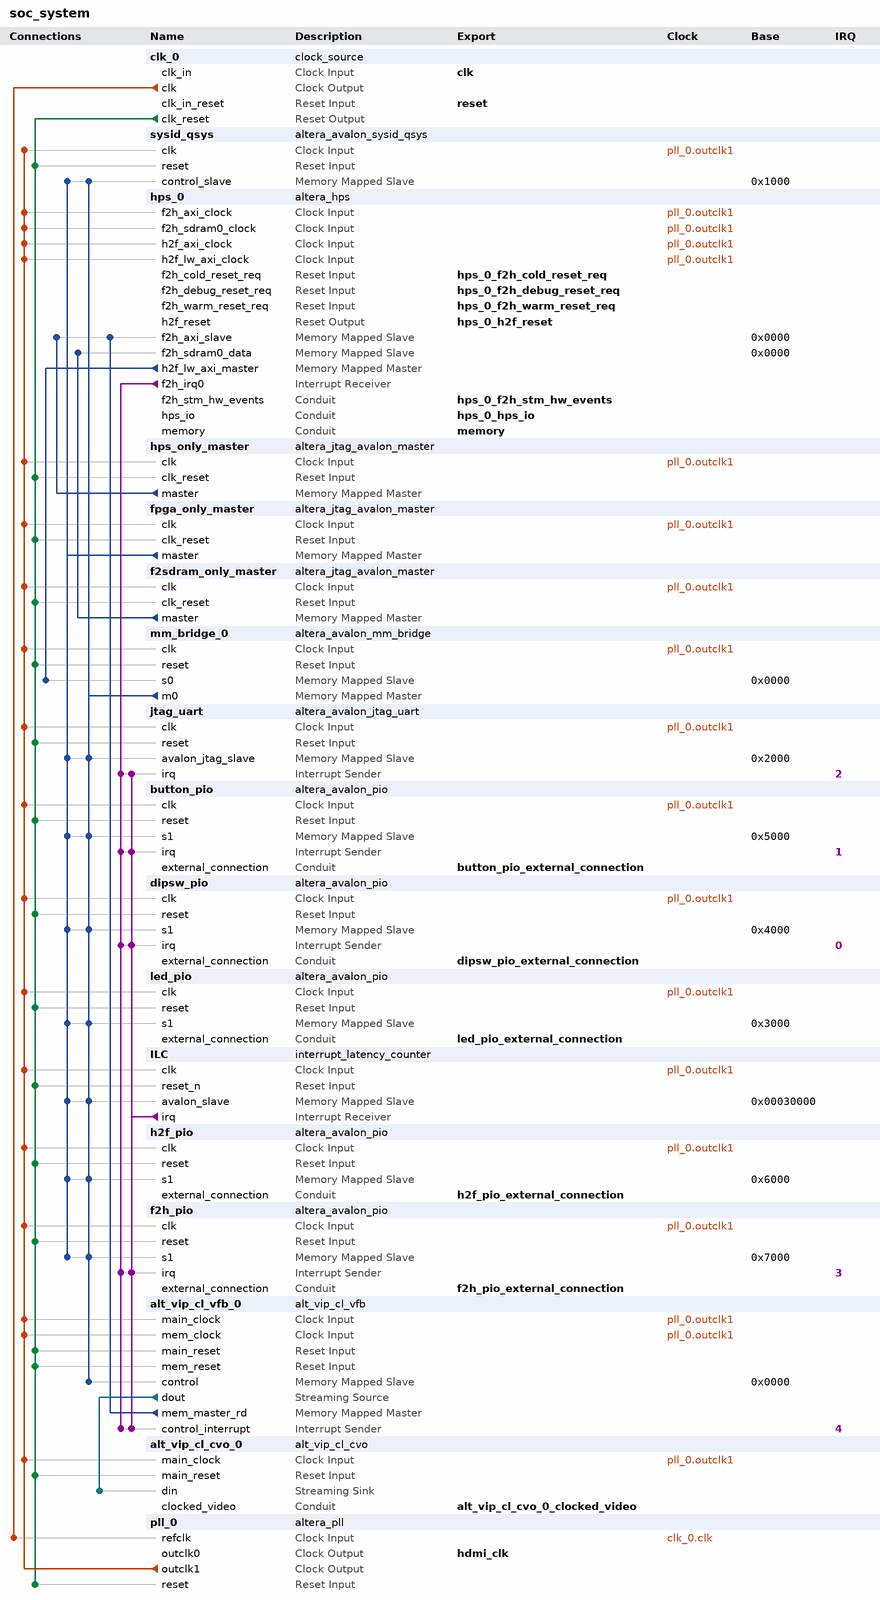
[diagram p0: system contents]
# Platform Designer (Qsys) system soc_system, Cyclone V 5CSEBA6U23I7
# Parameters at their usual value, and those the tool derives, are not listed.
package require -exact qsys 20.1
create_system soc_system
set_project_property DEVICE_FAMILY {Cyclone V}
set_project_property DEVICE 5CSEBA6U23I7

add_instance clk_0 clock_source 20.1
set_instance_parameter_value clk_0 clockFrequency 50000000

add_instance sysid_qsys altera_avalon_sysid_qsys 20.1
set_instance_parameter_value sysid_qsys id -1395322110

add_instance hps_0 altera_hps 20.1
set_instance_parameter_value hps_0 EMAC1_Mode RGMII
set_instance_parameter_value hps_0 EMAC1_PinMuxing {HPS I/O Set 0}
set_instance_parameter_value hps_0 F2SCLK_COLDRST_Enable true
set_instance_parameter_value hps_0 F2SCLK_DBGRST_Enable true
set_instance_parameter_value hps_0 F2SCLK_WARMRST_Enable true
set_instance_parameter_value hps_0 F2SDRAM_Type {Avalon-MM Bidirectional}
set_instance_parameter_value hps_0 F2SDRAM_Width 256
set_instance_parameter_value hps_0 F2SINTERRUPT_Enable true
set_instance_parameter_value hps_0 F2S_Width 3
set_instance_parameter_value hps_0 FPGA_PERIPHERAL_OUTPUT_CLOCK_FREQ_EMAC0_GTX_CLK 100
set_instance_parameter_value hps_0 FPGA_PERIPHERAL_OUTPUT_CLOCK_FREQ_EMAC0_MD_CLK 100.0
set_instance_parameter_value hps_0 FPGA_PERIPHERAL_OUTPUT_CLOCK_FREQ_EMAC1_GTX_CLK 100
set_instance_parameter_value hps_0 FPGA_PERIPHERAL_OUTPUT_CLOCK_FREQ_EMAC1_MD_CLK 100.0
set_instance_parameter_value hps_0 HPS_PROTOCOL DDR3
set_instance_parameter_value hps_0 I2C0_Mode I2C
set_instance_parameter_value hps_0 I2C0_PinMuxing {HPS I/O Set 0}
set_instance_parameter_value hps_0 I2C1_Mode I2C
set_instance_parameter_value hps_0 I2C1_PinMuxing {HPS I/O Set 0}
set_instance_parameter_value hps_0 LWH2F_Enable true
set_instance_parameter_value hps_0 MEM_BANKADDR_WIDTH 3
set_instance_parameter_value hps_0 MEM_CLK_FREQ 400.0
set_instance_parameter_value hps_0 MEM_COL_ADDR_WIDTH 10
set_instance_parameter_value hps_0 MEM_DQ_WIDTH 32
set_instance_parameter_value hps_0 MEM_DRV_STR RZQ/6
set_instance_parameter_value hps_0 MEM_ROW_ADDR_WIDTH 15
set_instance_parameter_value hps_0 MEM_RTT_NOM RZQ/6
set_instance_parameter_value hps_0 MEM_RTT_WR {Dynamic ODT off}
set_instance_parameter_value hps_0 MEM_TCL 7
set_instance_parameter_value hps_0 MEM_TFAW_NS 37.5
set_instance_parameter_value hps_0 MEM_TRAS_NS 35.0
set_instance_parameter_value hps_0 MEM_TRCD_NS 13.75
set_instance_parameter_value hps_0 MEM_TRFC_NS 300.0
set_instance_parameter_value hps_0 MEM_TRP_NS 13.75
set_instance_parameter_value hps_0 MEM_VENDOR Other
set_instance_parameter_value hps_0 MEM_WTCL 7
set_instance_parameter_value hps_0 QSPI_Mode N/A
set_instance_parameter_value hps_0 QSPI_PinMuxing Unused
set_instance_parameter_value hps_0 REF_CLK_FREQ 25.0
set_instance_parameter_value hps_0 S2FCLK_USER2CLK 4
set_instance_parameter_value hps_0 S2F_Width 2
set_instance_parameter_value hps_0 SDIO_Mode {4-bit Data}
set_instance_parameter_value hps_0 SDIO_PinMuxing {HPS I/O Set 0}
set_instance_parameter_value hps_0 SPIM1_Mode {Single Slave Select}
set_instance_parameter_value hps_0 SPIM1_PinMuxing {HPS I/O Set 0}
set_instance_parameter_value hps_0 STM_Enable true
set_instance_parameter_value hps_0 TIMING_BOARD_AC_SKEW 0.02
set_instance_parameter_value hps_0 TIMING_BOARD_AC_TO_CK_SKEW 0.0
set_instance_parameter_value hps_0 TIMING_BOARD_DQ_TO_DQS_SKEW 0.0
set_instance_parameter_value hps_0 TIMING_BOARD_MAX_CK_DELAY 0.6
set_instance_parameter_value hps_0 TIMING_BOARD_MAX_DQS_DELAY 0.6
set_instance_parameter_value hps_0 TIMING_BOARD_SKEW_BETWEEN_DQS 0.02
set_instance_parameter_value hps_0 TIMING_BOARD_SKEW_CKDQS_DIMM_MAX 0.01
set_instance_parameter_value hps_0 TIMING_BOARD_SKEW_CKDQS_DIMM_MIN -0.01
set_instance_parameter_value hps_0 TIMING_BOARD_SKEW_WITHIN_DQS 0.02
set_instance_parameter_value hps_0 TIMING_TDH 125
set_instance_parameter_value hps_0 TIMING_TDQSCK 400
set_instance_parameter_value hps_0 TIMING_TDQSQ 120
set_instance_parameter_value hps_0 TIMING_TDS 50
set_instance_parameter_value hps_0 TIMING_TIH 250
set_instance_parameter_value hps_0 TIMING_TIS 175
set_instance_parameter_value hps_0 TIMING_TQSH 0.38
set_instance_parameter_value hps_0 UART0_Mode {No Flow Control}
set_instance_parameter_value hps_0 UART0_PinMuxing {HPS I/O Set 0}
set_instance_parameter_value hps_0 USB1_Mode SDR
set_instance_parameter_value hps_0 USB1_PinMuxing {HPS I/O Set 0}
set_instance_parameter_value hps_0 desired_cfg_clk_mhz 100.0
set_instance_parameter_value hps_0 desired_qspi_clk_mhz 370.0

add_instance hps_only_master altera_jtag_avalon_master 20.1

add_instance fpga_only_master altera_jtag_avalon_master 20.1

add_instance f2sdram_only_master altera_jtag_avalon_master 20.1

add_instance mm_bridge_0 altera_avalon_mm_bridge 20.1
set_instance_parameter_value mm_bridge_0 ADDRESS_UNITS SYMBOLS
set_instance_parameter_value mm_bridge_0 ADDRESS_WIDTH 10
set_instance_parameter_value mm_bridge_0 DATA_WIDTH 32
set_instance_parameter_value mm_bridge_0 MAX_PENDING_RESPONSES 4
set_instance_parameter_value mm_bridge_0 USE_AUTO_ADDRESS_WIDTH 1

add_instance jtag_uart altera_avalon_jtag_uart 20.1
set_instance_parameter_value jtag_uart allowMultipleConnections true
set_instance_parameter_value jtag_uart simInteractiveOptions INTERACTIVE_ASCII_OUTPUT

add_instance button_pio altera_avalon_pio 20.1
set_instance_parameter_value button_pio bitClearingEdgeCapReg true
set_instance_parameter_value button_pio captureEdge true
set_instance_parameter_value button_pio direction Input
set_instance_parameter_value button_pio edgeType FALLING
set_instance_parameter_value button_pio generateIRQ true
set_instance_parameter_value button_pio irqType EDGE
set_instance_parameter_value button_pio width 2

add_instance dipsw_pio altera_avalon_pio 20.1
set_instance_parameter_value dipsw_pio bitClearingEdgeCapReg true
set_instance_parameter_value dipsw_pio captureEdge true
set_instance_parameter_value dipsw_pio direction Input
set_instance_parameter_value dipsw_pio edgeType ANY
set_instance_parameter_value dipsw_pio generateIRQ true
set_instance_parameter_value dipsw_pio irqType EDGE
set_instance_parameter_value dipsw_pio width 4

add_instance led_pio altera_avalon_pio 20.1
set_instance_parameter_value led_pio direction Output
set_instance_parameter_value led_pio resetValue 127
set_instance_parameter_value led_pio width 7

add_instance ILC interrupt_latency_counter 20.1
set_instance_parameter_value ILC CLOCK_RATE 100000000
set_instance_parameter_value ILC IRQ_PORT_CNT 5

add_instance h2f_pio altera_avalon_pio 20.1
set_instance_parameter_value h2f_pio direction Output
set_instance_parameter_value h2f_pio width 32

add_instance f2h_pio altera_avalon_pio 20.1
set_instance_parameter_value f2h_pio captureEdge true
set_instance_parameter_value f2h_pio direction Input
set_instance_parameter_value f2h_pio edgeType ANY
set_instance_parameter_value f2h_pio generateIRQ true
set_instance_parameter_value f2h_pio irqType EDGE
set_instance_parameter_value f2h_pio width 32

add_instance alt_vip_cl_vfb_0 alt_vip_cl_vfb 20.1
set_instance_parameter_value alt_vip_cl_vfb_0 CLOCKS_ARE_SEPARATE 1
set_instance_parameter_value alt_vip_cl_vfb_0 DROP_FRAMES 1
set_instance_parameter_value alt_vip_cl_vfb_0 DROP_INVALID_FIELDS 1
set_instance_parameter_value alt_vip_cl_vfb_0 DROP_REPEAT_USER 1
set_instance_parameter_value alt_vip_cl_vfb_0 IS_FRAME_READER 1
set_instance_parameter_value alt_vip_cl_vfb_0 LINE_BASED_BUFFERING 0
set_instance_parameter_value alt_vip_cl_vfb_0 MAX_HEIGHT 768
set_instance_parameter_value alt_vip_cl_vfb_0 MAX_WIDTH 1024
set_instance_parameter_value alt_vip_cl_vfb_0 MEM_BASE_ADDR 0
set_instance_parameter_value alt_vip_cl_vfb_0 MEM_BUFFER_OFFSET 16777216
set_instance_parameter_value alt_vip_cl_vfb_0 MEM_PORT_WIDTH 128
set_instance_parameter_value alt_vip_cl_vfb_0 NUMBER_OF_COLOR_PLANES 4
set_instance_parameter_value alt_vip_cl_vfb_0 PRIORITIZE_FMAX 0
set_instance_parameter_value alt_vip_cl_vfb_0 READER_RUNTIME_CONTROL 1
set_instance_parameter_value alt_vip_cl_vfb_0 READ_BURST_TARGET 2
set_instance_parameter_value alt_vip_cl_vfb_0 READ_FIFO_DEPTH 64
set_instance_parameter_value alt_vip_cl_vfb_0 USER_PACKETS_MAX_STORAGE 0
set_instance_parameter_value alt_vip_cl_vfb_0 USE_BUFFER_OFFSET 0
set_instance_parameter_value alt_vip_cl_vfb_0 WRITE_BURST_TARGET 2
set_instance_parameter_value alt_vip_cl_vfb_0 WRITE_FIFO_DEPTH 64

add_instance alt_vip_cl_cvo_0 alt_vip_cl_cvo 20.1
set_instance_parameter_value alt_vip_cl_cvo_0 ACCEPT_COLOURS_IN_SEQ 0
set_instance_parameter_value alt_vip_cl_cvo_0 ACCEPT_SYNC 0
set_instance_parameter_value alt_vip_cl_cvo_0 ANC_LINE 0
set_instance_parameter_value alt_vip_cl_cvo_0 AP_LINE 0
set_instance_parameter_value alt_vip_cl_cvo_0 BPS 8
set_instance_parameter_value alt_vip_cl_cvo_0 CLOCKS_ARE_SAME 0
set_instance_parameter_value alt_vip_cl_cvo_0 COLOUR_PLANES_ARE_IN_PARALLEL 1
set_instance_parameter_value alt_vip_cl_cvo_0 CONTEXT_WIDTH 8
set_instance_parameter_value alt_vip_cl_cvo_0 COUNT_STEP_IS_PIP_VALUE 0
set_instance_parameter_value alt_vip_cl_cvo_0 DST_WIDTH 8
set_instance_parameter_value alt_vip_cl_cvo_0 FIELD0_ANC_LINE 0
set_instance_parameter_value alt_vip_cl_cvo_0 FIELD0_V_BACK_PORCH 0
set_instance_parameter_value alt_vip_cl_cvo_0 FIELD0_V_BLANK 0
set_instance_parameter_value alt_vip_cl_cvo_0 FIELD0_V_FRONT_PORCH 0
set_instance_parameter_value alt_vip_cl_cvo_0 FIELD0_V_RISING_EDGE 0
set_instance_parameter_value alt_vip_cl_cvo_0 FIELD0_V_SYNC_LENGTH 0
set_instance_parameter_value alt_vip_cl_cvo_0 FIFO_DEPTH 1024
set_instance_parameter_value alt_vip_cl_cvo_0 F_FALLING_EDGE 0
set_instance_parameter_value alt_vip_cl_cvo_0 F_RISING_EDGE 0
set_instance_parameter_value alt_vip_cl_cvo_0 GENERATE_SYNC 0
set_instance_parameter_value alt_vip_cl_cvo_0 H_ACTIVE_PIXELS 1024
set_instance_parameter_value alt_vip_cl_cvo_0 H_BACK_PORCH 160
set_instance_parameter_value alt_vip_cl_cvo_0 H_BLANK 0
set_instance_parameter_value alt_vip_cl_cvo_0 H_FRONT_PORCH 24
set_instance_parameter_value alt_vip_cl_cvo_0 H_SYNC_LENGTH 136
set_instance_parameter_value alt_vip_cl_cvo_0 INTERLACED 0
set_instance_parameter_value alt_vip_cl_cvo_0 LOW_LATENCY 1
set_instance_parameter_value alt_vip_cl_cvo_0 NO_OF_CHANNELS 1
set_instance_parameter_value alt_vip_cl_cvo_0 NO_OF_MODES 1
set_instance_parameter_value alt_vip_cl_cvo_0 NUMBER_OF_COLOUR_PLANES 4
set_instance_parameter_value alt_vip_cl_cvo_0 PIXELS_IN_PARALLEL 1
set_instance_parameter_value alt_vip_cl_cvo_0 SRC_WIDTH 8
set_instance_parameter_value alt_vip_cl_cvo_0 STD_WIDTH 1
set_instance_parameter_value alt_vip_cl_cvo_0 TASK_WIDTH 8
set_instance_parameter_value alt_vip_cl_cvo_0 THRESHOLD 1024
set_instance_parameter_value alt_vip_cl_cvo_0 USE_CONTROL 0
set_instance_parameter_value alt_vip_cl_cvo_0 USE_EMBEDDED_SYNCS 0
set_instance_parameter_value alt_vip_cl_cvo_0 V_ACTIVE_LINES 768
set_instance_parameter_value alt_vip_cl_cvo_0 V_BACK_PORCH 29
set_instance_parameter_value alt_vip_cl_cvo_0 V_BLANK 0
set_instance_parameter_value alt_vip_cl_cvo_0 V_FRONT_PORCH 3
set_instance_parameter_value alt_vip_cl_cvo_0 V_SYNC_LENGTH 6

add_instance pll_0 altera_pll 20.1
set_instance_parameter_value pll_0 gui_device_speed_grade 1
set_instance_parameter_value pll_0 gui_dsm_out_sel disable
set_instance_parameter_value pll_0 gui_fractional_cout 8
set_instance_parameter_value pll_0 gui_number_of_clocks 2
set_instance_parameter_value pll_0 gui_operation_mode direct
set_instance_parameter_value pll_0 gui_output_clock_frequency0 65.0
set_instance_parameter_value pll_0 gui_output_clock_frequency1 100.0
set_instance_parameter_value pll_0 gui_pll_mode {Integer-N PLL}
set_instance_parameter_value pll_0 gui_reference_clock_frequency 50.0
set_instance_parameter_value pll_0 gui_use_locked false

# connections
add_connection clk_0.clk pll_0.refclk clock
add_connection pll_0.outclk1 alt_vip_cl_cvo_0.main_clock clock
add_connection pll_0.outclk1 alt_vip_cl_vfb_0.main_clock clock
add_connection pll_0.outclk1 alt_vip_cl_vfb_0.mem_clock clock
add_connection pll_0.outclk1 button_pio.clk clock
add_connection pll_0.outclk1 dipsw_pio.clk clock
add_connection pll_0.outclk1 f2h_pio.clk clock
add_connection pll_0.outclk1 f2sdram_only_master.clk clock
add_connection pll_0.outclk1 fpga_only_master.clk clock
add_connection pll_0.outclk1 h2f_pio.clk clock
add_connection pll_0.outclk1 hps_0.f2h_axi_clock clock
add_connection pll_0.outclk1 hps_0.f2h_sdram0_clock clock
add_connection pll_0.outclk1 hps_0.h2f_axi_clock clock
add_connection pll_0.outclk1 hps_0.h2f_lw_axi_clock clock
add_connection pll_0.outclk1 hps_only_master.clk clock
add_connection pll_0.outclk1 ILC.clk clock
add_connection pll_0.outclk1 jtag_uart.clk clock
add_connection pll_0.outclk1 led_pio.clk clock
add_connection pll_0.outclk1 mm_bridge_0.clk clock
add_connection pll_0.outclk1 sysid_qsys.clk clock
add_connection clk_0.clk_reset alt_vip_cl_cvo_0.main_reset reset
add_connection clk_0.clk_reset alt_vip_cl_vfb_0.main_reset reset
add_connection clk_0.clk_reset alt_vip_cl_vfb_0.mem_reset reset
add_connection clk_0.clk_reset button_pio.reset reset
add_connection clk_0.clk_reset dipsw_pio.reset reset
add_connection clk_0.clk_reset f2h_pio.reset reset
add_connection clk_0.clk_reset f2sdram_only_master.clk_reset reset
add_connection clk_0.clk_reset fpga_only_master.clk_reset reset
add_connection clk_0.clk_reset h2f_pio.reset reset
add_connection clk_0.clk_reset hps_only_master.clk_reset reset
add_connection clk_0.clk_reset ILC.reset_n reset
add_connection clk_0.clk_reset jtag_uart.reset reset
add_connection clk_0.clk_reset led_pio.reset reset
add_connection clk_0.clk_reset mm_bridge_0.reset reset
add_connection clk_0.clk_reset pll_0.reset reset
add_connection clk_0.clk_reset sysid_qsys.reset reset
add_connection alt_vip_cl_vfb_0.mem_master_rd hps_0.f2h_axi_slave avalon
set_connection_parameter_value alt_vip_cl_vfb_0.mem_master_rd/hps_0.f2h_axi_slave baseAddress 0x0000
add_connection f2sdram_only_master.master hps_0.f2h_sdram0_data avalon
set_connection_parameter_value f2sdram_only_master.master/hps_0.f2h_sdram0_data baseAddress 0x0000
add_connection fpga_only_master.master button_pio.s1 avalon
set_connection_parameter_value fpga_only_master.master/button_pio.s1 baseAddress 0x5000
add_connection fpga_only_master.master dipsw_pio.s1 avalon
set_connection_parameter_value fpga_only_master.master/dipsw_pio.s1 baseAddress 0x4000
add_connection fpga_only_master.master f2h_pio.s1 avalon
set_connection_parameter_value fpga_only_master.master/f2h_pio.s1 baseAddress 0x7000
add_connection fpga_only_master.master h2f_pio.s1 avalon
set_connection_parameter_value fpga_only_master.master/h2f_pio.s1 baseAddress 0x6000
add_connection fpga_only_master.master ILC.avalon_slave avalon
set_connection_parameter_value fpga_only_master.master/ILC.avalon_slave baseAddress 0x00030000
add_connection fpga_only_master.master jtag_uart.avalon_jtag_slave avalon
set_connection_parameter_value fpga_only_master.master/jtag_uart.avalon_jtag_slave baseAddress 0x2000
add_connection fpga_only_master.master led_pio.s1 avalon
set_connection_parameter_value fpga_only_master.master/led_pio.s1 baseAddress 0x3000
add_connection fpga_only_master.master sysid_qsys.control_slave avalon
set_connection_parameter_value fpga_only_master.master/sysid_qsys.control_slave baseAddress 0x1000
add_connection hps_0.h2f_lw_axi_master mm_bridge_0.s0 avalon
set_connection_parameter_value hps_0.h2f_lw_axi_master/mm_bridge_0.s0 baseAddress 0x0000
add_connection hps_only_master.master hps_0.f2h_axi_slave avalon
set_connection_parameter_value hps_only_master.master/hps_0.f2h_axi_slave baseAddress 0x0000
add_connection mm_bridge_0.m0 alt_vip_cl_vfb_0.control avalon
set_connection_parameter_value mm_bridge_0.m0/alt_vip_cl_vfb_0.control baseAddress 0x0000
add_connection mm_bridge_0.m0 button_pio.s1 avalon
set_connection_parameter_value mm_bridge_0.m0/button_pio.s1 baseAddress 0x5000
add_connection mm_bridge_0.m0 dipsw_pio.s1 avalon
set_connection_parameter_value mm_bridge_0.m0/dipsw_pio.s1 baseAddress 0x4000
add_connection mm_bridge_0.m0 f2h_pio.s1 avalon
set_connection_parameter_value mm_bridge_0.m0/f2h_pio.s1 baseAddress 0x7000
add_connection mm_bridge_0.m0 h2f_pio.s1 avalon
set_connection_parameter_value mm_bridge_0.m0/h2f_pio.s1 baseAddress 0x6000
add_connection mm_bridge_0.m0 ILC.avalon_slave avalon
set_connection_parameter_value mm_bridge_0.m0/ILC.avalon_slave baseAddress 0x00030000
add_connection mm_bridge_0.m0 jtag_uart.avalon_jtag_slave avalon
set_connection_parameter_value mm_bridge_0.m0/jtag_uart.avalon_jtag_slave baseAddress 0x2000
add_connection mm_bridge_0.m0 led_pio.s1 avalon
set_connection_parameter_value mm_bridge_0.m0/led_pio.s1 baseAddress 0x3000
add_connection mm_bridge_0.m0 sysid_qsys.control_slave avalon
set_connection_parameter_value mm_bridge_0.m0/sysid_qsys.control_slave baseAddress 0x1000
add_connection alt_vip_cl_vfb_0.dout alt_vip_cl_cvo_0.din avalon_streaming
add_connection hps_0.f2h_irq0 alt_vip_cl_vfb_0.control_interrupt interrupt
set_connection_parameter_value hps_0.f2h_irq0/alt_vip_cl_vfb_0.control_interrupt irqNumber 4
add_connection hps_0.f2h_irq0 button_pio.irq interrupt
set_connection_parameter_value hps_0.f2h_irq0/button_pio.irq irqNumber 1
add_connection hps_0.f2h_irq0 dipsw_pio.irq interrupt
set_connection_parameter_value hps_0.f2h_irq0/dipsw_pio.irq irqNumber 0
add_connection hps_0.f2h_irq0 f2h_pio.irq interrupt
set_connection_parameter_value hps_0.f2h_irq0/f2h_pio.irq irqNumber 3
add_connection hps_0.f2h_irq0 jtag_uart.irq interrupt
set_connection_parameter_value hps_0.f2h_irq0/jtag_uart.irq irqNumber 2
add_connection ILC.irq alt_vip_cl_vfb_0.control_interrupt interrupt
set_connection_parameter_value ILC.irq/alt_vip_cl_vfb_0.control_interrupt irqNumber 4
add_connection ILC.irq button_pio.irq interrupt
set_connection_parameter_value ILC.irq/button_pio.irq irqNumber 1
add_connection ILC.irq dipsw_pio.irq interrupt
set_connection_parameter_value ILC.irq/dipsw_pio.irq irqNumber 0
add_connection ILC.irq f2h_pio.irq interrupt
set_connection_parameter_value ILC.irq/f2h_pio.irq irqNumber 3
add_connection ILC.irq jtag_uart.irq interrupt
set_connection_parameter_value ILC.irq/jtag_uart.irq irqNumber 2

# exported interfaces
add_interface alt_vip_cl_cvo_0_clocked_video conduit end
set_interface_property alt_vip_cl_cvo_0_clocked_video EXPORT_OF alt_vip_cl_cvo_0.clocked_video
add_interface button_pio_external_connection conduit end
set_interface_property button_pio_external_connection EXPORT_OF button_pio.external_connection
add_interface clk clock sink
set_interface_property clk EXPORT_OF clk_0.clk_in
add_interface dipsw_pio_external_connection conduit end
set_interface_property dipsw_pio_external_connection EXPORT_OF dipsw_pio.external_connection
add_interface f2h_pio_external_connection conduit end
set_interface_property f2h_pio_external_connection EXPORT_OF f2h_pio.external_connection
add_interface h2f_pio_external_connection conduit end
set_interface_property h2f_pio_external_connection EXPORT_OF h2f_pio.external_connection
add_interface hdmi_clk clock source
set_interface_property hdmi_clk EXPORT_OF pll_0.outclk0
add_interface hps_0_f2h_cold_reset_req reset sink
set_interface_property hps_0_f2h_cold_reset_req EXPORT_OF hps_0.f2h_cold_reset_req
add_interface hps_0_f2h_debug_reset_req reset sink
set_interface_property hps_0_f2h_debug_reset_req EXPORT_OF hps_0.f2h_debug_reset_req
add_interface hps_0_f2h_stm_hw_events conduit end
set_interface_property hps_0_f2h_stm_hw_events EXPORT_OF hps_0.f2h_stm_hw_events
add_interface hps_0_f2h_warm_reset_req reset sink
set_interface_property hps_0_f2h_warm_reset_req EXPORT_OF hps_0.f2h_warm_reset_req
add_interface hps_0_h2f_reset reset source
set_interface_property hps_0_h2f_reset EXPORT_OF hps_0.h2f_reset
add_interface hps_0_hps_io conduit end
set_interface_property hps_0_hps_io EXPORT_OF hps_0.hps_io
add_interface led_pio_external_connection conduit end
set_interface_property led_pio_external_connection EXPORT_OF led_pio.external_connection
add_interface memory conduit end
set_interface_property memory EXPORT_OF hps_0.memory
add_interface reset reset sink
set_interface_property reset EXPORT_OF clk_0.clk_in_reset

set_interconnect_requirement {$system} qsys_mm.clockCrossingAdapter HANDSHAKE
set_interconnect_requirement {$system} qsys_mm.maxAdditionalLatency 1

save_system soc_system.qsys
